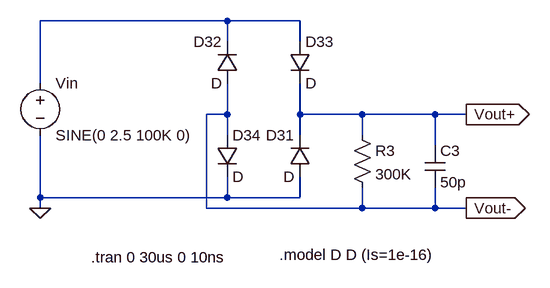
[diagram p0: schematic HW1 2-c.asc]
HW1 2-c.asc, the LTspice schematic file:
Version 4
SHEET 1 880 680
WIRE 240 16 -48 16
WIRE 352 16 240 16
WIRE 240 48 240 16
WIRE 352 48 352 16
WIRE -48 112 -48 16
WIRE 240 160 240 112
WIRE 240 160 208 160
WIRE 352 160 352 112
WIRE 448 160 352 160
WIRE 560 160 448 160
WIRE 608 160 560 160
WIRE 240 192 240 160
WIRE 352 192 352 160
WIRE 448 192 448 160
WIRE 560 208 560 160
WIRE -48 288 -48 192
WIRE 240 288 240 256
WIRE 240 288 -48 288
WIRE 352 288 352 256
WIRE 352 288 240 288
WIRE -48 304 -48 288
WIRE 208 304 208 160
WIRE 448 304 448 272
WIRE 448 304 208 304
WIRE 560 304 560 272
WIRE 560 304 448 304
WIRE 608 304 560 304
FLAG -48 304 0
FLAG 608 160 Vout+
IOPIN 608 160 Out
FLAG 608 304 Vout-
IOPIN 608 304 Out
SYMBOL voltage -48 96 R0
WINDOW 123 0 0 Left 0
WINDOW 39 0 0 Left 0
SYMATTR InstName Vin
SYMATTR Value SINE(0 2.5 100K 0)
SYMBOL diode 336 48 R0
SYMATTR InstName D33
SYMBOL diode 256 112 R180
WINDOW 0 24 64 Left 2
WINDOW 3 24 0 Left 2
SYMATTR InstName D32
SYMBOL diode 368 256 R180
WINDOW 0 24 64 Left 2
WINDOW 3 24 0 Left 2
SYMATTR InstName D31
SYMBOL diode 224 192 R0
SYMATTR InstName D34
SYMBOL res 432 176 R0
SYMATTR InstName R3
SYMATTR Value 300K
SYMBOL cap 544 208 R0
SYMATTR InstName C3
SYMATTR Value 50p
TEXT 320 376 Left 2 !.model D D (Is=1e-16)
TEXT 30 380 Left 2 !.tran 0 30us 0 10ns

The netlist it stands for:
* HW1 2-c.asc
Vin N001 0 SINE(0 2.5 100K 0)
D33 N001 Vout+ D
D32 Vout- N001 D
D31 0 Vout+ D
D34 Vout- 0 D
R3 Vout+ Vout- 300K
C3 Vout+ Vout- 50p
.model D D
.lib standard.dio
.model D D (Is=1e-16)
.tran 0 30us 0 10ns
.backanno
.end